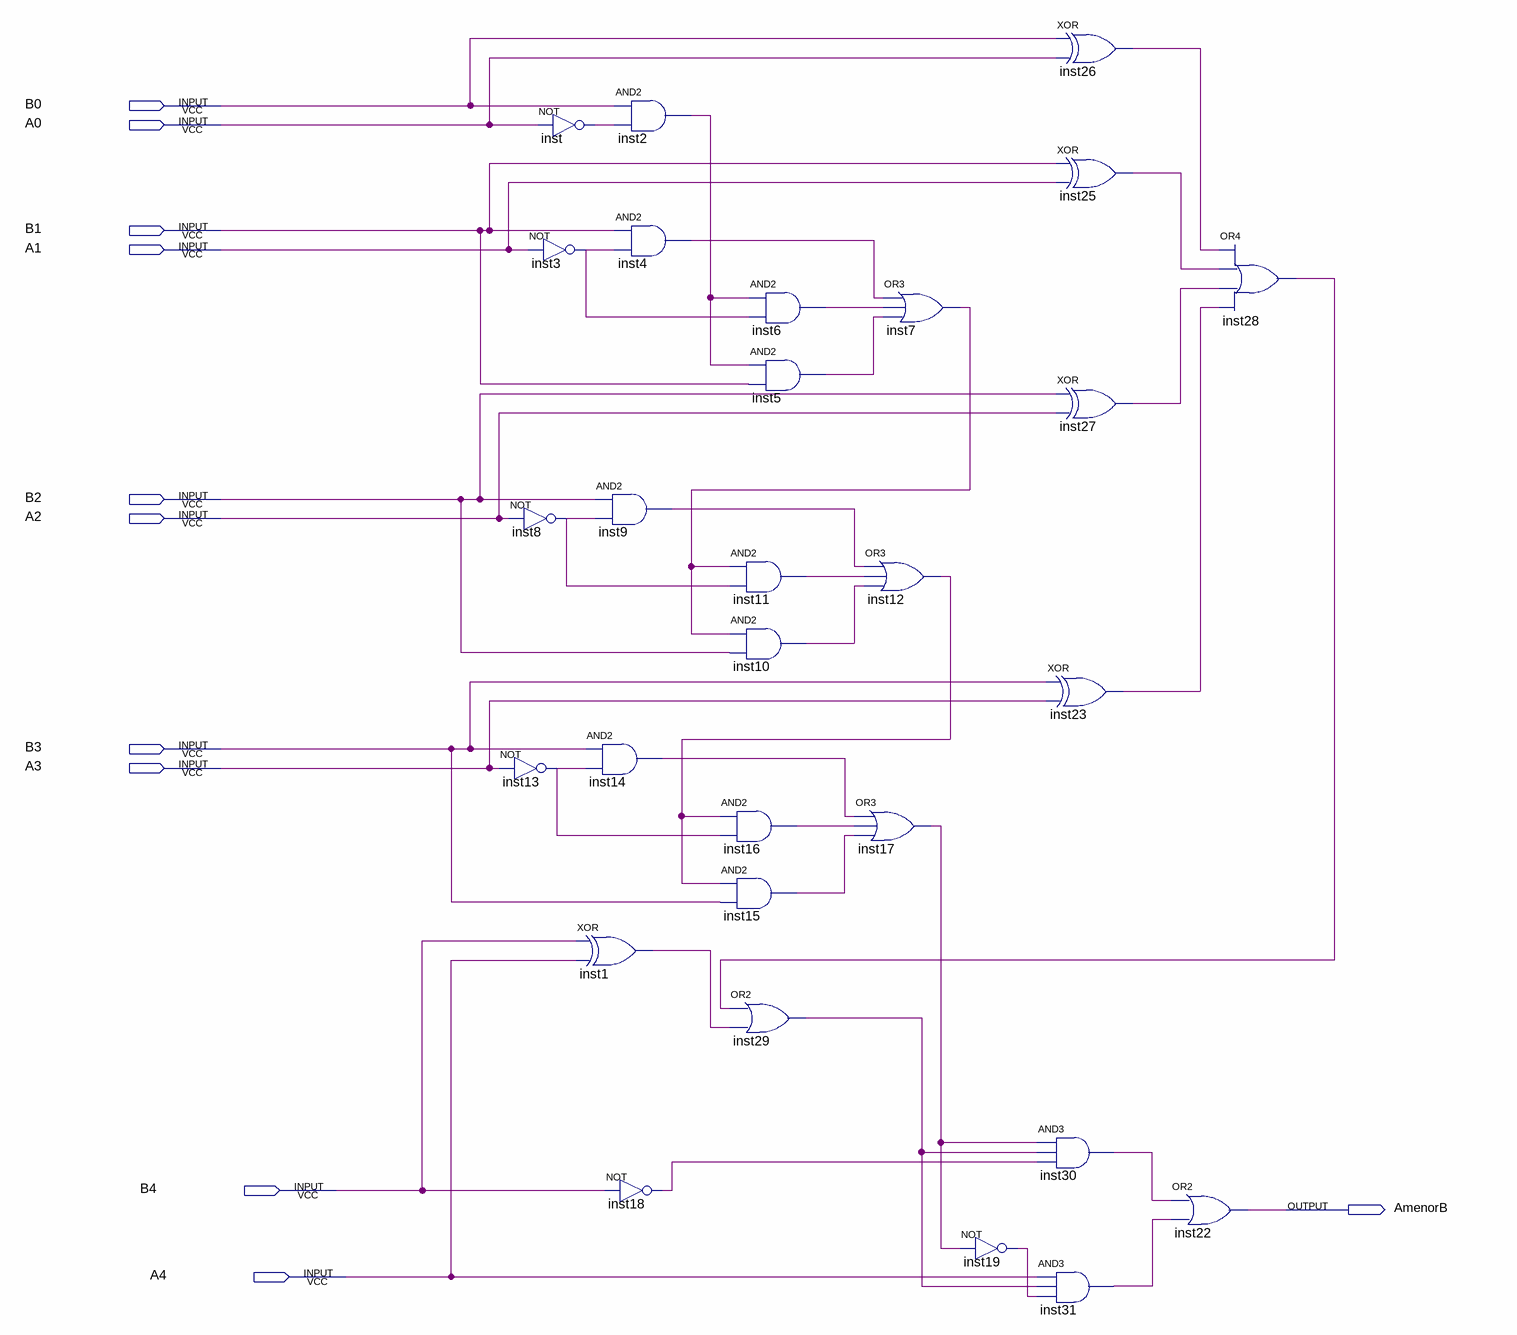
[diagram p0: schematic sheet]
// Quartus schematic A_Menor_B.bdf as structural Verilog: 29 symbols, 11 pins
module A_Menor_B (
  input  B0,
  input  A0,
  input  B1,
  input  A1,
  input  B2,
  input  A2,
  input  B3,
  input  A3,
  input  B4,
  input  A4,
  output AmenorB
);

  wire inst1_out, inst2_out, inst3_out, inst4_out, inst5_out, inst6_out, inst7_out, inst8_out, inst9_out,
       inst10_out, inst11_out, inst12_out, inst13_out, inst14_out, inst15_out, inst16_out, inst17_out,
       inst18_out, inst19_out, inst23_out, inst25_out, inst26_out, inst27_out, inst28_out, inst29_out,
       inst30_out, inst31_out, inst_out;

  not inst8 (inst8_out, A2);
  not inst13 (inst13_out, A3);
  not inst (inst_out, A0);
  not inst3 (inst3_out, A1);
  and inst9 (inst9_out, B2, inst8_out);
  and inst14 (inst14_out, B3, inst13_out);
  xor inst1 (inst1_out, B4, A4);
  and inst2 (inst2_out, B0, inst_out);
  and inst4 (inst4_out, B1, inst3_out);
  not inst18 (inst18_out, B4);
  and inst6 (inst6_out, inst2_out, inst3_out);
  and inst5 (inst5_out, inst2_out, B1);
  and inst11 (inst11_out, inst7_out, inst8_out);
  and inst10 (inst10_out, inst7_out, B2);
  and inst16 (inst16_out, inst12_out, inst13_out);
  and inst15 (inst15_out, inst12_out, B3);
  or inst29 (inst29_out, inst28_out, inst1_out);
  or inst7 (inst7_out, inst4_out, inst6_out, inst5_out);
  or inst12 (inst12_out, inst9_out, inst11_out, inst10_out);
  or inst17 (inst17_out, inst14_out, inst16_out, inst15_out);
  not inst19 (inst19_out, inst17_out);
  xor inst26 (inst26_out, B0, A0);
  xor inst25 (inst25_out, B1, A1);
  xor inst27 (inst27_out, B2, A2);
  xor inst23 (inst23_out, B3, A3);
  and inst30 (inst30_out, inst17_out, inst29_out, inst18_out);
  and inst31 (inst31_out, A4, inst29_out, inst19_out);
  or inst22 (AmenorB, inst30_out, inst31_out);
  or inst28 (inst28_out, inst26_out, inst25_out, inst27_out, inst23_out);
endmodule
